# Altium project pmtPCB.PrjPCB
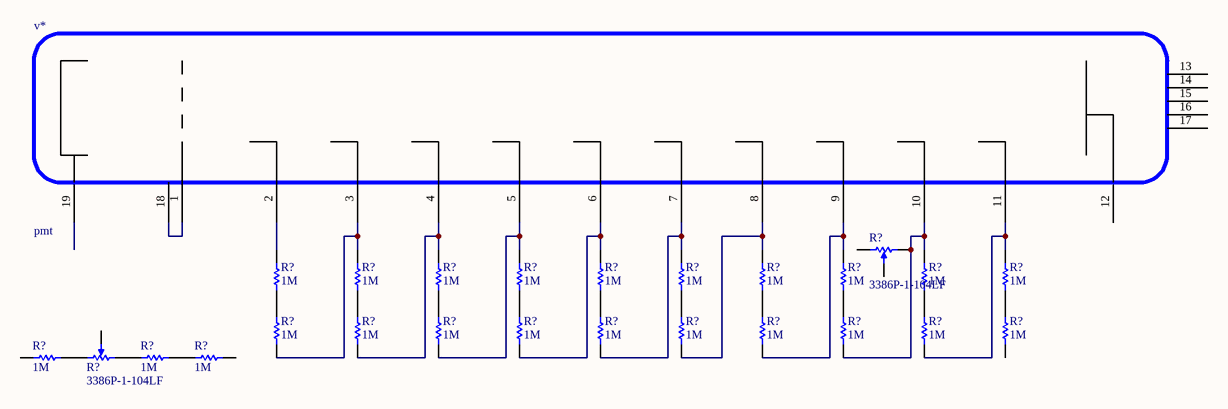
[diagram p0: main.SchDoc]
1 sheet, 26 parts. Net scope: global (net labels, ports and power ports of the same name join across sheets).

## Sheet main.SchDoc
size A3

### Parts
(Parts that share a designator on the sheet are numbered #1, #2 ... from top to bottom, then left to right.)
R?#1  3386P-1-104LF  [BOUR-3386P]
R?#2  1M  [RESC0805(2012)_M]
R?#3  1M  [RESC0805(2012)_M]
R?#4  1M  [RESC0805(2012)_M]
R?#5  1M  [RESC0805(2012)_M]
R?#6  1M  [RESC0805(2012)_M]
R?#7  1M  [RESC0805(2012)_M]
R?#8  1M  [RESC0805(2012)_M]
R?#9  1M  [RESC0805(2012)_M]
R?#10  1M  [RESC0805(2012)_M]
R?#11  1M  [RESC0805(2012)_M]
R?#12  1M  [RESC0805(2012)_M]
R?#13  1M  [RESC0805(2012)_M]
R?#14  1M  [RESC0805(2012)_M]
R?#15  1M  [RESC0805(2012)_M]
R?#16  1M  [RESC0805(2012)_M]
R?#17  1M  [RESC0805(2012)_M]
R?#18  1M  [RESC0805(2012)_M]
R?#19  1M  [RESC0805(2012)_M]
R?#20  1M  [RESC0805(2012)_M]
R?#21  1M  [RESC0805(2012)_M]
R?#22  3386P-1-104LF  [BOUR-3386P]
R?#23  1M  [RESC0805(2012)_M]
R?#24  1M  [RESC0805(2012)_M]
R?#25  1M  [RESC0805(2012)_M]
v*  pmt

### Nets
NetR?#1_3: R?#1.3 R?#10.2 R?#19.2 v*.10(D9)
NetR?#2_1: R?#2.1 R?#12.1
NetR?#2_2: R?#2.2 v*.2(D1)
NetR?#3_1: R?#3.1 R?#13.1
NetR?#3_2: R?#3.2 R?#12.2 v*.3(D2)
NetR?#4_1: R?#4.1 R?#14.1
NetR?#4_2: R?#4.2 R?#13.2 v*.4(D3)
NetR?#5_1: R?#5.1 R?#15.1
NetR?#5_2: R?#5.2 R?#14.2 v*.5(D4)
NetR?#6_1: R?#6.1 R?#16.1
NetR?#6_2: R?#6.2 R?#15.2 v*.6(D5)
NetR?#7_1: R?#7.1 R?#17.1
NetR?#7_2: R?#7.2 R?#16.2 v*.7(D6)
NetR?#8_1: R?#8.1 R?#18.1
NetR?#8_2: R?#8.2 R?#17.2 v*.8(D7)
NetR?#9_1: R?#9.1 R?#19.1
NetR?#9_2: R?#9.2 R?#18.2 v*.9(D8)
NetR?#10_1: R?#10.1 R?#20.1
NetR?#11_1: R?#11.1 R?#21.1
NetR?#11_2: R?#11.2 R?#20.2 v*.11(D10)
NetR?#22_1: R?#22.1 R?#24.2
NetR?#22_3: R?#22.3 R?#23.1
NetR?#24_1: R?#24.1 R?#25.2
Netv*_1: v*.1(G) v*.18(G)

Not connected (* = marked no-connect by the designer): R?#1 1 2; R?#21 2; R?#22 2; R?#23 2; R?#25 1; v* 12(A) 13(NC) 14(NC) 15(NC) 16(NC) 17(NC) 19(K)

### Library data of the parts
R?#1 R?#22 = CMP-2000-05592-1: Square Trimpot(R) Trimming Potentiometer, 100 KOhm, +/- 10%, 0.5 W, -55 to 125 degC, 3-Pin THD, RoHS, Tube; Manufacturer Series: 3386; Manufacturer: Bourns; Resistive Element Material: Cermet; Shaft Diameter: 3.15mm; Number of Turns: 1; Product Height: 4.83mm; Temperature Coefficient: 100ppm/C; Product Depth: 9.53mm; Rated Temperature (Cel): 85; Actuator Orientation: Vertical; Resistance (ohm): 100000; Power Rating: 1/2W; Tolerance (%): 10; Rated Power Dissipation (P) (W): 0.5; Resistance Law: Linear; Actuator Type: Screw; Operating Temperature-Min (Cel): -55; Manufacturer URL: http://www.bourns.com/; Terminal Finish: TINLEAD; Datasheet Version: 05/2016; Tolerance: 10%; Lead Free: NO; Family: 3386; Product Length: 9.53mm; Mounting: ThroughHole; Packaging: Tube; Package: RectangularPackage; Mounting Feature: ThroughHole; Number of Terminals: 3; Minimum Operating Temperature: -55C; Mounting Technology: ThroughHole; Package Reference: 3386P; Maximum Operating Temperature: 125C; Termination Style: Pin; Datasheet URL: http://www.bourns.com/docs/Product-Datasheets/3386.pdf; Package Description: 3-Pin Through Hole Device, Body 9.53 x 9.53 mm, Pitch 2.54 mm; Product Type: Potentiometer; Operating Temperature-Max (Cel): 125; Resistance Value: 100KOhm; Terminal Shape: WIRE; Technology: Cermet; Type: Trimmer
R?#2-R?#21 R?#23-R?#25 = CMP-1013-00564-1: 1M 0.5% 25ppm; Power: 0.125 W; Value: 3090.00 Ohm; Case-EIA: 0805; Tolerance: 1 %; Case-Metric: 2012; Technology: SMT